# Altium schematic sheet 5.UnitConnector.SchDoc
size A4; DocumentNumber: 6; SheetNumber: 6; SheetTotal: 6
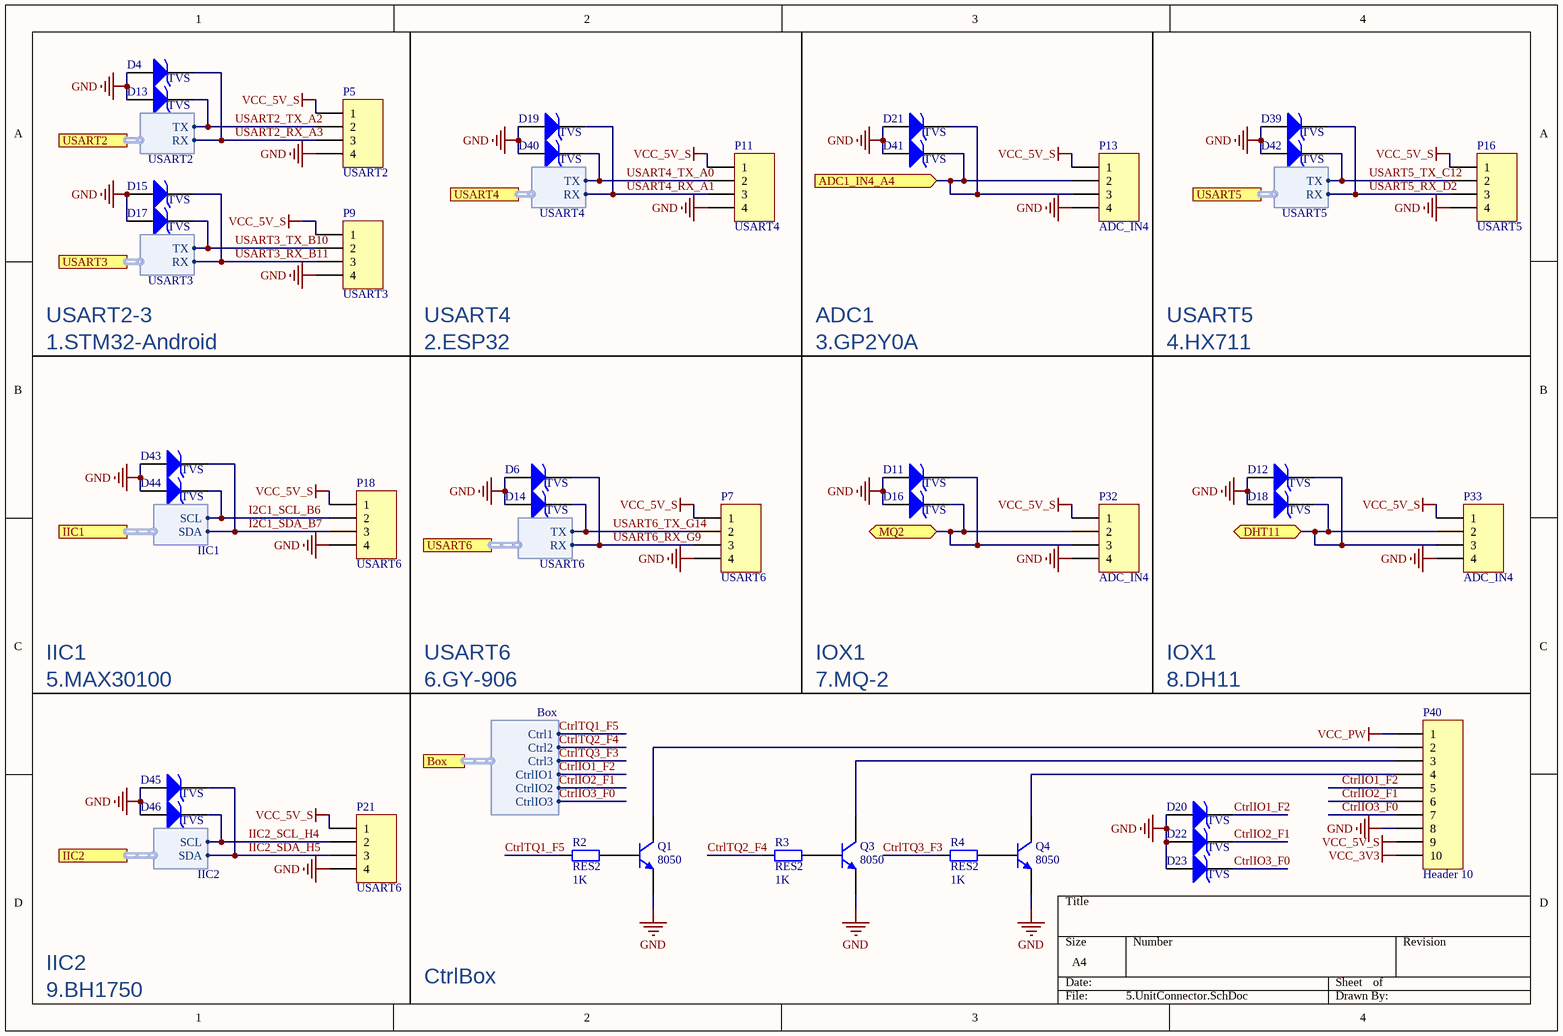
[diagram p0: 5.UnitConnector.SchDoc]

## Parts
D4  TVS  [SOD-523]
D6  TVS  [SOD-523]
D11  TVS  [SOD-523]
D12  TVS  [SOD-523]
D13  TVS  [SOD-523]
D14  TVS  [SOD-523]
D15  TVS  [SOD-523]
D16  TVS  [SOD-523]
D17  TVS  [SOD-523]
D18  TVS  [SOD-523]
D19  TVS  [SOD-523]
D20  TVS  [SOD-523]
D21  TVS  [SOD-523]
D22  TVS  [SOD-523]
D23  TVS  [SOD-523]
D39  TVS  [SOD-523]
D40  TVS  [SOD-523]
D41  TVS  [SOD-523]
D42  TVS  [SOD-523]
D43  TVS  [SOD-523]
D44  TVS  [SOD-523]
D45  TVS  [SOD-523]
D46  TVS  [SOD-523]
P5  USART2  [KF2EDGK-2.54-WI-4P]
P7  USART6  [KF2EDGK-2.54-WI-4P]
P9  USART3  [KF2EDGK-2.54-WI-4P]
P11  USART4  [KF2EDGK-2.54-WI-4P]
P13  ADC_IN4  [KF2EDGK-2.54-WI-4P]
P16  USART5  [KF2EDGK-2.54-WI-4P]
P18  USART6  [KF2EDGK-2.54-WI-4P]
P21  USART6  [KF2EDGK-2.54-WI-4P]
P32  ADC_IN4  [KF2EDGK-2.54-WI-4P]
P33  ADC_IN4  [KF2EDGK-2.54-WI-4P]
P40  Header 10  [KF2EDGK-2.54-WI-10P]
Q1  8050  [SOT23-3L]
Q3  8050  [SOT23-3L]
Q4  8050  [SOT23-3L]
R2  RES2  value 1K  [R 0805_L]
R3  RES2  value 1K  [R 0805_L]
R4  RES2  value 1K  [R 0805_L]

## Ports
ADC1_IN4_A4 (in), Box (harness Box), DHT11 (bidir), IIC1 (harness IIC1), IIC2 (harness IIC2), MQ2 (bidir), USART2 (harness USART2), USART3 (harness USART3), USART4 (harness USART4), USART5 (harness USART5), USART6 (harness USART6)

## Harnesses
USART2: TX, RX
USART3: RX, TX
USART6: TX, RX
USART4: TX, RX
USART5: TX, RX
IIC1: SCL, SDA
IIC2: SCL, SDA
Box: Ctrl1, Ctrl2, Ctrl3, CtrlIO1, CtrlIO2, CtrlIO3

## Nets
GND: D4.1(A) D6.1(A) D11.1(A) D12.1(A) D13.1(A) D14.1(A) D15.1(A) D16.1(A) D17.1(A) D18.1(A) D19.1(A) D20.1(A) D21.1(A) D22.1(A) D23.1(A) D39.1(A) D40.1(A) D41.1(A) D42.1(A) D43.1(A) D44.1(A) D45.1(A) D46.1(A) P5.4 P7.4 P9.4 P11.4 P13.4 P16.4 P18.4 P21.4 P32.4 P33.4 P40.8 Q1.2(E) Q3.2(E) Q4.2(E)
VCC_3V3: P40.10
VCC_5V_S: P5.1 P7.1 P9.1 P11.1 P13.1 P16.1 P18.1 P21.1 P32.1 P33.1 P40.9
VCC_PW: P40.1
ADC1_IN4_A4: D21.2(K) D41.2(K) P13.2 P13.3 ; port ADC1_IN4_A4
CtrlIO1_F2: D20.2(K) P40.5 ; port Box.CtrlIO1
CtrlIO2_F1: D22.2(K) P40.6 ; port Box.CtrlIO2
CtrlIO3_F0: D23.2(K) P40.7 ; port Box.CtrlIO3
CtrlTQ1_F5: R2.2 ; port Box.Ctrl1
CtrlTQ2_F4: R3.2 ; port Box.Ctrl2
CtrlTQ3_F3: R4.2 ; port Box.Ctrl3
DHT11: D12.2(K) D18.2(K) P33.2 P33.3 ; port DHT11
I2C1_SCL_B6: D44.2(K) P18.2 ; port IIC1.SCL
I2C1_SDA_B7: D43.2(K) P18.3 ; port IIC1.SDA
IIC2_SCL_H4: D46.2(K) P21.2 ; port IIC2.SCL
IIC2_SDA_H5: D45.2(K) P21.3 ; port IIC2.SDA
MQ2: D11.2(K) D16.2(K) P32.2 P32.3 ; port MQ2
USART2_RX_A3: D4.2(K) P5.3 ; port USART2.RX
USART2_TX_A2: D13.2(K) P5.2 ; port USART2.TX
USART3_RX_B11: D15.2(K) P9.3 ; port USART3.RX
USART3_TX_B10: D17.2(K) P9.2 ; port USART3.TX
USART4_RX_A1: D19.2(K) P11.3 ; port USART4.RX
USART4_TX_A0: D40.2(K) P11.2 ; port USART4.TX
USART5_RX_D2: D39.2(K) P16.3 ; port USART5.RX
USART5_TX_C12: D42.2(K) P16.2 ; port USART5.TX
USART6_RX_G9: D6.2(K) P7.3 ; port USART6.RX
USART6_TX_G14: D14.2(K) P7.2 ; port USART6.TX
NetP40_2: P40.2 Q1.3(C)
NetP40_3: P40.3 Q3.3(C)
NetP40_4: P40.4 Q4.3(C)
NetQ1_1: Q1.1(B) R2.1
NetQ3_1: Q3.1(B) R3.1
NetQ4_1: Q4.1(B) R4.1

## Notes on the sheet
- 1.STM32-Android
- USART2-3
- 2.ESP32
- USART4
- 3.GP2Y0A
- ADC1
- 4.HX711
- USART5
- 5.MAX30100
- IIC1
- 6.GY-906
- USART6
- 7.MQ-2
- IOX1
- 8.DH11
- IIC2
- CtrlBox
- 9.BH1750

## Library data of the parts
D4 D6 D11-D23 D39-D46 = D: High Conductance Fast Diode; Published: 8-Jun-2000; LatestRevisionDate: 17-Jul-2002; LatestRevisionNote: Re-released for DXP Platform.; DatasheetVersion: 1997; PackageReference: DO-35; Publisher: Altium Limited; PackageDescription: Diode, Axial; Body 3.8 x 1.9 mm (LxDia. max), Lead Dia. 0.53 mm (max); Code_JEDEC: DO-204-AH; ComponentLink1Description: Manufacturer Link; ComponentLink1URL: http://www.fairchildsemi.com/; ComponentLink2Description: Datasheet; ComponentLink2URL: http://www.fairchildsemi.com/ds/1N%2F1N4148.pdf
P5 P7 P9 P11 P13 P16 P18 P21 P32 P33 = Header 4: Header, 4-Pin; LatestRevisionDate: 17-Jul-2002; LatestRevisionNote: Re-released for DXP Platform.; Publisher: Altium Limited
P40 = Header 10: Header, 10-Pin; LatestRevisionDate: 17-Jul-2002; LatestRevisionNote: Re-released for DXP Platform.; Publisher: Altium Limited
Q1 Q3 Q4 = NPN  SOT: NPN Bipolar Transistor; Published: 8-Jun-2000; LatestRevisionDate: 17-Jul-2002; LatestRevisionNote: Re-released for DXP Platform.; PackageReference: TO-226-AA; Publisher: Altium Limited; PackageDescription: TO, Flat Index; 3 In-Line, Axial Leads; Body Dia. 4.8mm; Leads 0.55 x 0.51 mm (max); Code_JEDEC: TO-226-AA
R2-R4 = RES2: Resistor; Published: 8-Jun-2000; LatestRevisionDate: 17-Jul-2002; LatestRevisionNote: Re-released for DXP Platform.; PackageReference: AXIAL-0.3; Publisher: Altium Limited; PackageDescription: Axial Device, Thru-Hole; 2 Leads; 0.3 in Pin Spacing